# EAGLE schematic breakout_spartan6 (EAGLE 5.12)

## Sheet 1 of 4
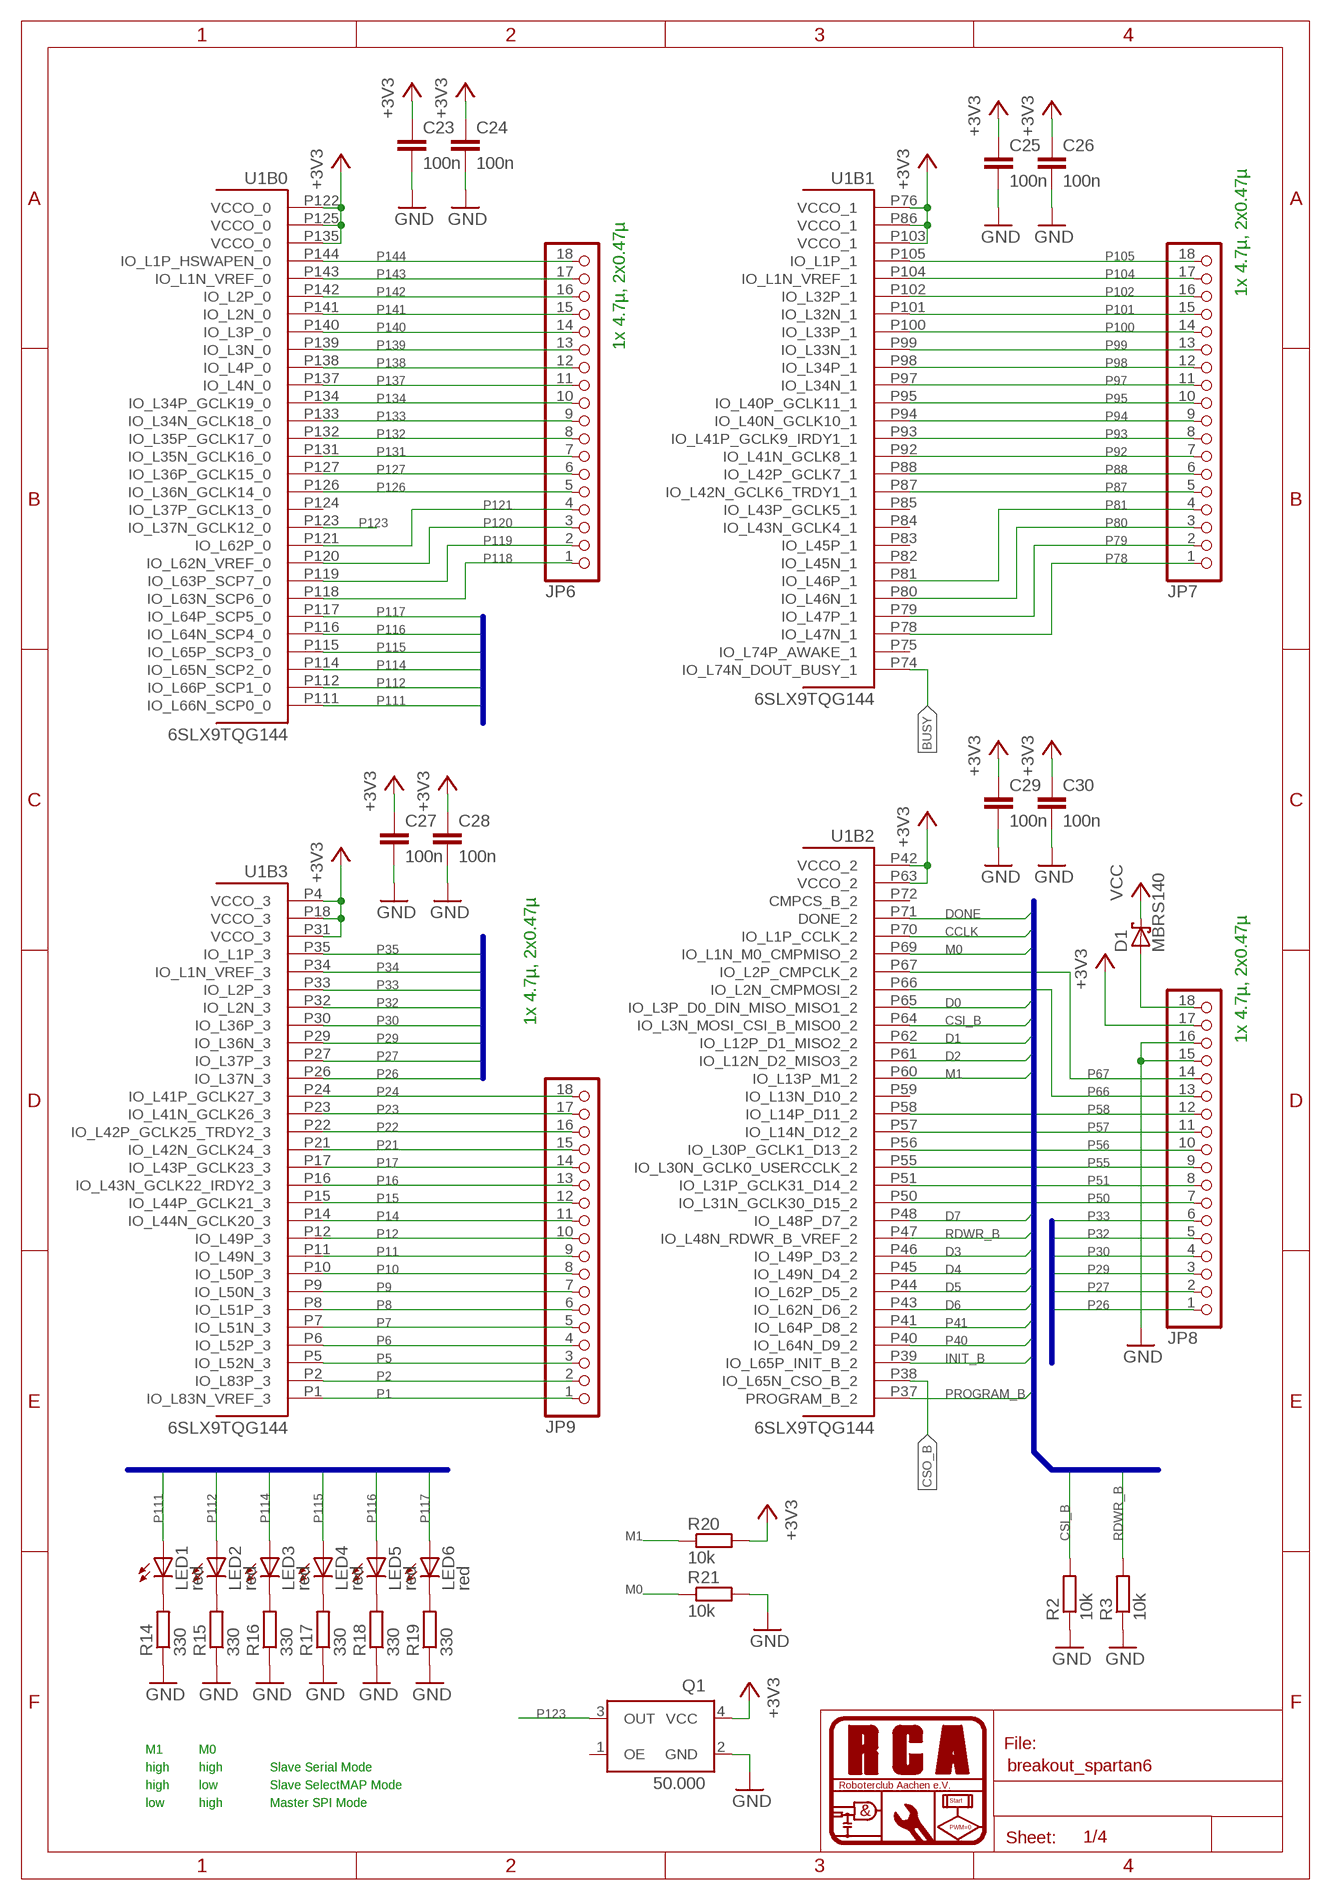
[diagram p0: schematic, sheet 1]

### Parts
C23  100n  C-EUC0603  [C0603]
C24  100n  C-EUC0603  [C0603]
C25  100n  C-EUC0603  [C0603]
C26  100n  C-EUC0603  [C0603]
C27  100n  C-EUC0603  [C0603]
C28  100n  C-EUC0603  [C0603]
C29  100n  C-EUC0603  [C0603]
C30  100n  C-EUC0603  [C0603]
D1  MBRS140  MBRS130LT3  [SMB]
JP6  PINHD-1X18_2.54  [1X18]
JP7  PINHD-1X18_2.54  [1X18]
JP8  PINHD-1X18_2.54  [1X18]
JP9  PINHD-1X18_2.54  [1X18]
LED1  red  LEDCHIP-LED0805  [CHIP-LED0805]
LED2  red  LEDCHIP-LED0805  [CHIP-LED0805]
LED3  red  LEDCHIP-LED0805  [CHIP-LED0805]
LED4  red  LEDCHIP-LED0805  [CHIP-LED0805]
LED5  red  LEDCHIP-LED0805  [CHIP-LED0805]
LED6  red  LEDCHIP-LED0805  [CHIP-LED0805]
Q1  50.000  XO53S  [XO53_SMALL]
R2  10k  R-EU_R0805  [R0805]
R3  10k  R-EU_R0805  [R0805]
R14  330  R-EU_R0805  [R0805]
R15  330  R-EU_R0805  [R0805]
R16  330  R-EU_R0805  [R0805]
R17  330  R-EU_R0805  [R0805]
R18  330  R-EU_R0805  [R0805]
R19  330  R-EU_R0805  [R0805]
R20  10k  R-EU_R0805  [R0805]
R21  10k  R-EU_R0805  [R0805]
U1  6SLX9TQG144  [TQ144]

### Nets
+3V3: C23.1 C24.1 C25.1 C26.1 C27.1 C28.1 C29.1 C30.1 JP8.17 Q1.4(VCC) R20.2 U1.P4(B3:VCCO_3) U1.P18(B3:VCCO_3) U1.P31(B3:VCCO_3) U1.P42(B2:VCCO_2) U1.P63(B2:VCCO_2) U1.P76(B1:VCCO_1) U1.P86(B1:VCCO_1) U1.P103(B1:VCCO_1) U1.P122(B0:VCCO_0) U1.P125(B0:VCCO_0) U1.P135(B0:VCCO_0) ; also sheet 2,4
BUSY: U1.P74(B1:IO_L74N_DOUT_BUSY_1)
CCLK: U1.P70(B2:IO_L1P_CCLK_2) ; also sheet 3
CSI_B: R2.2 U1.P64(B2:IO_L3N_MOSI_CSI_B_MISO0_2)
CSO_B: U1.P38(B2:IO_L65N_CSO_B_2)
D0: U1.P65(B2:IO_L3P_D0_DIN_MISO_MISO1_2) ; also sheet 3
D1: U1.P62(B2:IO_L12P_D1_MISO2_2) ; also sheet 3
D2: U1.P61(B2:IO_L12N_D2_MISO3_2) ; also sheet 3
D3: U1.P46(B2:IO_L49P_D3_2) ; also sheet 3
D4: U1.P45(B2:IO_L49N_D4_2) ; also sheet 3
D5: U1.P44(B2:IO_L62P_D5_2) ; also sheet 3
D6: U1.P43(B2:IO_L62N_D6_2) ; also sheet 3
D7: U1.P48(B2:IO_L48P_D7_2) ; also sheet 3
DONE: U1.P71(B2:DONE_2) ; also sheet 3
GND: C23.2 C24.2 C25.2 C26.2 C27.2 C28.2 C29.2 C30.2 JP8.15 JP8.16 Q1.2(GND) R2.1 R3.1 R14.1 R15.1 R16.1 R17.1 R18.1 R19.1 R21.2 ; also sheet 2,3,4
INIT_B: U1.P39(B2:IO_L65P_INIT_B_2) ; also sheet 3
M0: R21.1 U1.P69(B2:IO_L1N_M0_CMPMISO_2)
M1: R20.1 U1.P60(B2:IO_L13P_M1_2)
N$52: LED1.C R14.2
N$53: D1.A JP8.18
N$54: LED2.C R15.2
N$55: LED3.C R16.2
N$56: LED4.C R17.2
N$57: LED5.C R18.2
N$58: LED6.C R19.2
P1: JP9.1 U1.P1(B3:IO_L83N_VREF_3)
P2: JP9.2 U1.P2(B3:IO_L83P_3)
P5: JP9.3 U1.P5(B3:IO_L52N_3)
P6: JP9.4 U1.P6(B3:IO_L52P_3)
P7: JP9.5 U1.P7(B3:IO_L51N_3)
P8: JP9.6 U1.P8(B3:IO_L51P_3)
P9: JP9.7 U1.P9(B3:IO_L50N_3)
P10: JP9.8 U1.P10(B3:IO_L50P_3)
P11: JP9.9 U1.P11(B3:IO_L49N_3)
P12: JP9.10 U1.P12(B3:IO_L49P_3)
P14: JP9.11 U1.P14(B3:IO_L44N_GCLK20_3)
P15: JP9.12 U1.P15(B3:IO_L44P_GCLK21_3)
P16: JP9.13 U1.P16(B3:IO_L43N_GCLK22_IRDY2_3)
P17: JP9.14 U1.P17(B3:IO_L43P_GCLK23_3)
P21: JP9.15 U1.P21(B3:IO_L42N_GCLK24_3)
P22: JP9.16 U1.P22(B3:IO_L42P_GCLK25_TRDY2_3)
P23: JP9.17 U1.P23(B3:IO_L41N_GCLK26_3)
P24: JP9.18 U1.P24(B3:IO_L41P_GCLK27_3)
P26: JP8.1 U1.P26(B3:IO_L37N_3)
P27: JP8.2 U1.P27(B3:IO_L37P_3)
P29: JP8.3 U1.P29(B3:IO_L36N_3)
P30: JP8.4 U1.P30(B3:IO_L36P_3)
P32: JP8.5 U1.P32(B3:IO_L2N_3)
P33: JP8.6 U1.P33(B3:IO_L2P_3)
P34: U1.P34(B3:IO_L1N_VREF_3) ; also sheet 3
P35: U1.P35(B3:IO_L1P_3) ; also sheet 3
P40: U1.P40(B2:IO_L64N_D9_2) ; also sheet 3
P41: U1.P41(B2:IO_L64P_D8_2) ; also sheet 3
P50: JP8.7 U1.P50(B2:IO_L31N_GCLK30_D15_2)
P51: JP8.8 U1.P51(B2:IO_L31P_GCLK31_D14_2)
P55: JP8.9 U1.P55(B2:IO_L30N_GCLK0_USERCCLK_2)
P56: JP8.10 U1.P56(B2:IO_L30P_GCLK1_D13_2)
P57: JP8.11 U1.P57(B2:IO_L14N_D12_2)
P58: JP8.12 U1.P58(B2:IO_L14P_D11_2)
P66: JP8.13 U1.P66(B2:IO_L2N_CMPMOSI_2)
P67: JP8.14 U1.P67(B2:IO_L2P_CMPCLK_2)
P78: JP7.1 U1.P78(B1:IO_L47N_1)
P79: JP7.2 U1.P79(B1:IO_L47P_1)
P80: JP7.3 U1.P80(B1:IO_L46N_1)
P81: JP7.4 U1.P81(B1:IO_L46P_1)
P87: JP7.5 U1.P87(B1:IO_L42N_GCLK6_TRDY1_1)
P88: JP7.6 U1.P88(B1:IO_L42P_GCLK7_1)
P92: JP7.7 U1.P92(B1:IO_L41N_GCLK8_1)
P93: JP7.8 U1.P93(B1:IO_L41P_GCLK9_IRDY1_1)
P94: JP7.9 U1.P94(B1:IO_L40N_GCLK10_1)
P95: JP7.10 U1.P95(B1:IO_L40P_GCLK11_1)
P97: JP7.11 U1.P97(B1:IO_L34N_1)
P98: JP7.12 U1.P98(B1:IO_L34P_1)
P99: JP7.13 U1.P99(B1:IO_L33N_1)
P100: JP7.14 U1.P100(B1:IO_L33P_1)
P101: JP7.15 U1.P101(B1:IO_L32N_1)
P102: JP7.16 U1.P102(B1:IO_L32P_1)
P104: JP7.17 U1.P104(B1:IO_L1N_VREF_1)
P105: JP7.18 U1.P105(B1:IO_L1P_1)
P111: LED1.A U1.P111(B0:IO_L66N_SCP0_0)
P112: LED2.A U1.P112(B0:IO_L66P_SCP1_0)
P114: LED3.A U1.P114(B0:IO_L65N_SCP2_0)
P115: LED4.A U1.P115(B0:IO_L65P_SCP3_0)
P116: LED5.A U1.P116(B0:IO_L64N_SCP4_0)
P117: LED6.A U1.P117(B0:IO_L64P_SCP5_0)
P118: JP6.1 U1.P118(B0:IO_L63N_SCP6_0)
P119: JP6.2 U1.P119(B0:IO_L63P_SCP7_0)
P120: JP6.3 U1.P120(B0:IO_L62N_VREF_0)
P121: JP6.4 U1.P121(B0:IO_L62P_0)
P123: Q1.3(OUT) U1.P123(B0:IO_L37N_GCLK12_0)
P126: JP6.5 U1.P126(B0:IO_L36N_GCLK14_0)
P127: JP6.6 U1.P127(B0:IO_L36P_GCLK15_0)
P131: JP6.7 U1.P131(B0:IO_L35N_GCLK16_0)
P132: JP6.8 U1.P132(B0:IO_L35P_GCLK17_0)
P133: JP6.9 U1.P133(B0:IO_L34N_GCLK18_0)
P134: JP6.10 U1.P134(B0:IO_L34P_GCLK19_0)
P137: JP6.11 U1.P137(B0:IO_L4N_0)
P138: JP6.12 U1.P138(B0:IO_L4P_0)
P139: JP6.13 U1.P139(B0:IO_L3N_0)
P140: JP6.14 U1.P140(B0:IO_L3P_0)
P141: JP6.15 U1.P141(B0:IO_L2N_0)
P142: JP6.16 U1.P142(B0:IO_L2P_0)
P143: JP6.17 U1.P143(B0:IO_L1N_VREF_0)
P144: JP6.18 U1.P144(B0:IO_L1P_HSWAPEN_0)
PROGRAM_B: U1.P37(B2:PROGRAM_B_2) ; also sheet 3
RDWR_B: R3.2 U1.P47(B2:IO_L48N_RDWR_B_VREF_2)
VCC: D1.C ; also sheet 3,4
Unconnected: Q1.1(OE) U1.P59(B2:IO_L13N_D10_2) U1.P72(B2:CMPCS_B_2) U1.P75(B1:IO_L74P_AWAKE_1) U1.P82(B1:IO_L45N_1) U1.P83(B1:IO_L45P_1) U1.P84(B1:IO_L43N_GCLK4_1) U1.P85(B1:IO_L43P_GCLK5_1) U1.P124(B0:IO_L37P_GCLK13_0)

### Buses
CCLK,DONE,D[0..7],INIT_B,PROGRAM_B,CSI_B,RDWR_B,M[0..1],P[40..41]
P[26..27],P[29..30],P[32..35]
P[111..112],P[114..117]

### Notes on the sheet
- 1x 4.7µ, 2x0.47µ
- 1x 4.7µ, 2x0.47µ
- 1x 4.7µ, 2x0.47µ
- 1x 4.7µ, 2x0.47µ
- M1 | M0
- high | high | Slave Serial Mode
- high | low | Slave SelectMAP Mode
- low | high | Master SPI Mode

## Sheet 2 of 4
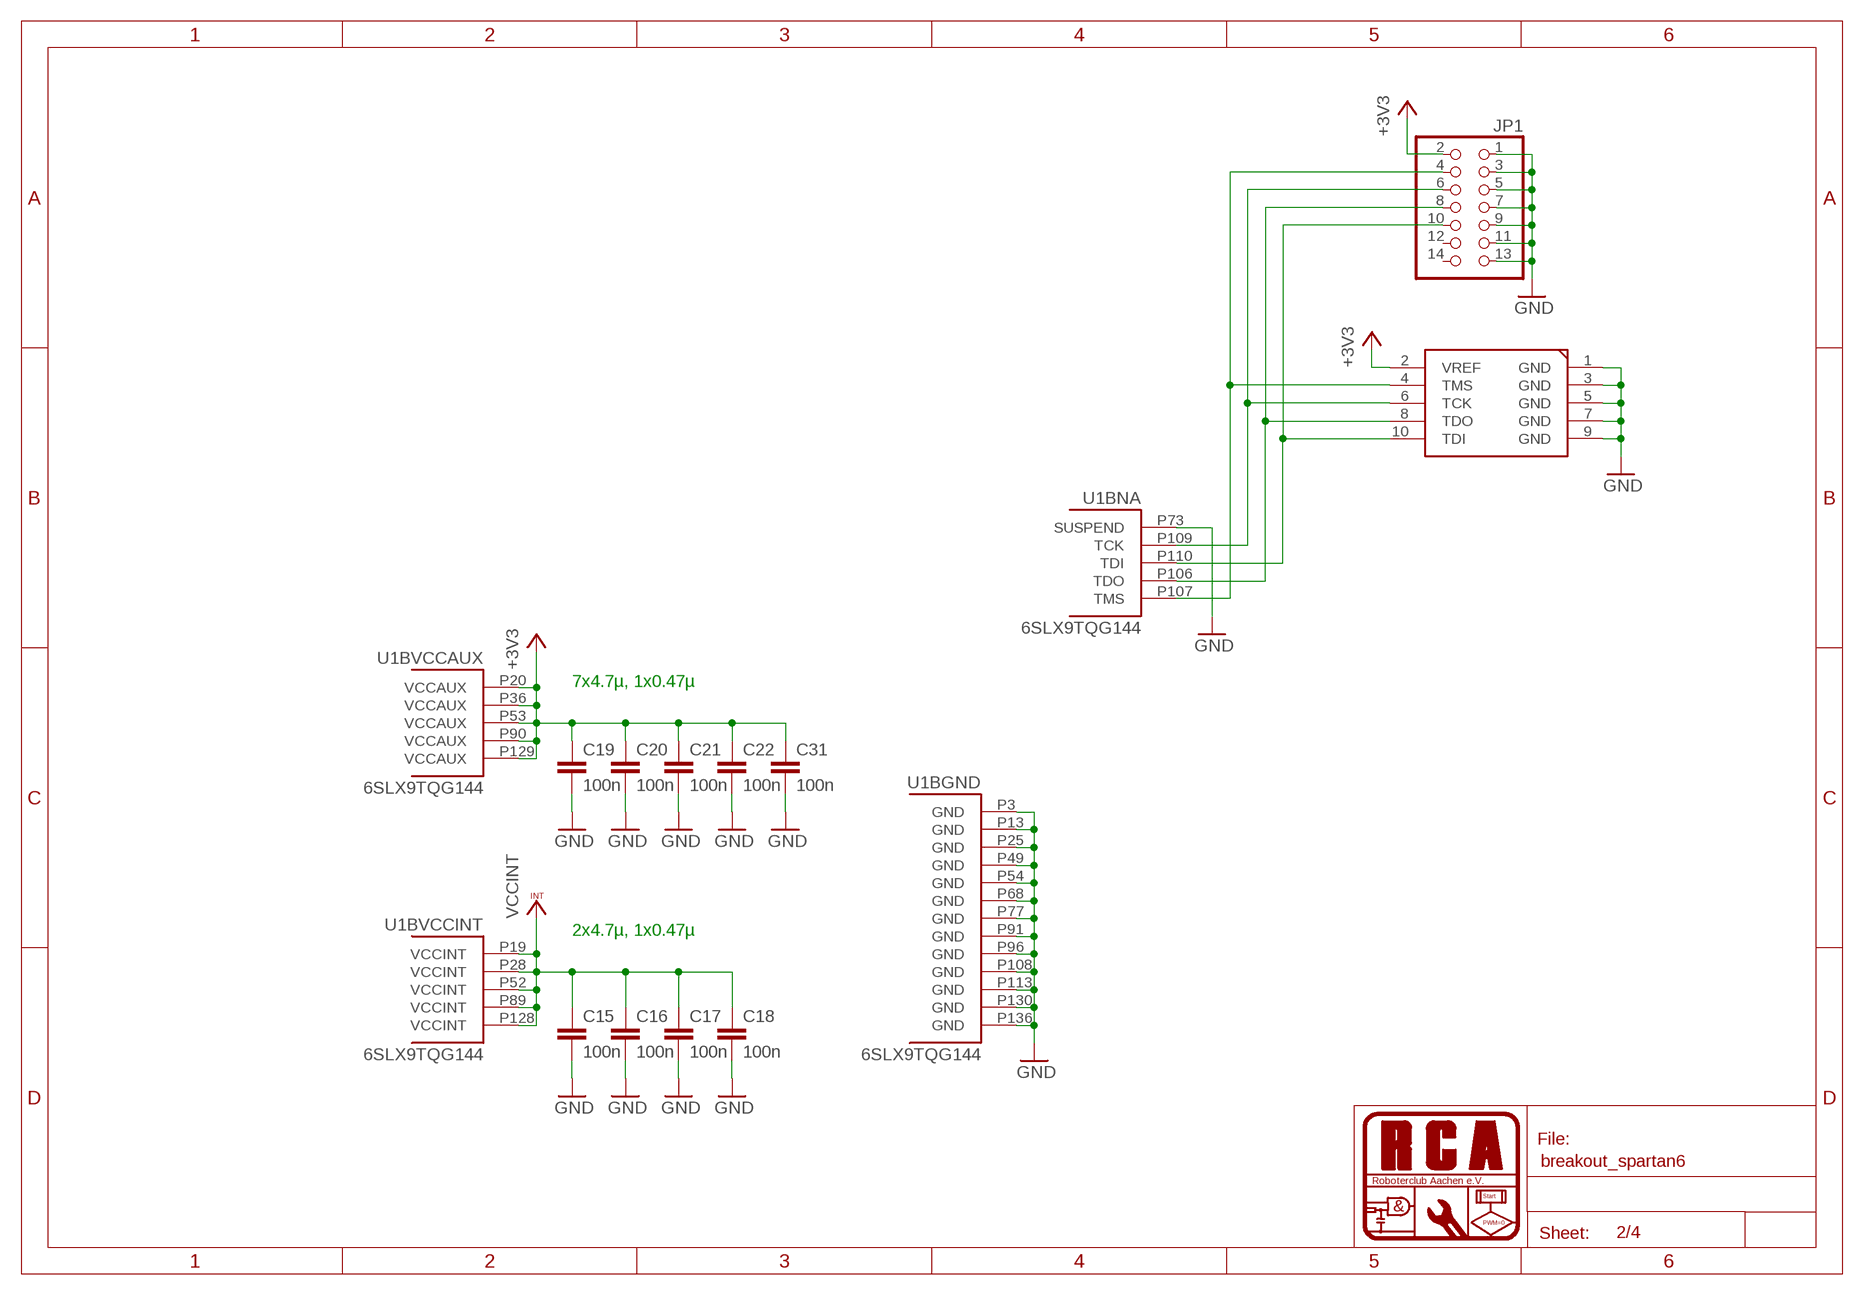
[diagram p1: schematic, sheet 2]

### Parts
C15  100n  C-EUC0603  [C0603]
C16  100n  C-EUC0603  [C0603]
C17  100n  C-EUC0603  [C0603]
C18  100n  C-EUC0603  [C0603]
C19  100n  C-EUC0603  [C0603]
C20  100n  C-EUC0603  [C0603]
C21  100n  C-EUC0603  [C0603]
C22  100n  C-EUC0603  [C0603]
C31  100n  C-EUC0603  [C0603]
J1  XILINX_JTAGSMD  [2X05SMD]
JP1  PINHD-2X7_2.00-SMD  [2X07M_SMD]

### Nets
+3V3: C19.1 C20.1 C21.1 C22.1 C31.1 J1.2(VREF) JP1.2 U1.P20(BVCCAUX:VCCAUX) U1.P36(BVCCAUX:VCCAUX) U1.P53(BVCCAUX:VCCAUX) U1.P90(BVCCAUX:VCCAUX) U1.P129(BVCCAUX:VCCAUX) ; also sheet 1,4
GND: C15.2 C16.2 C17.2 C18.2 C19.2 C20.2 C21.2 C22.2 C31.2 J1.1(GND) J1.3(GND) J1.5(GND) J1.7(GND) J1.9(GND) JP1.1 JP1.3 JP1.5 JP1.7 JP1.9 JP1.11 JP1.13 U1.P3(BGND:GND) U1.P13(BGND:GND) U1.P25(BGND:GND) U1.P49(BGND:GND) U1.P54(BGND:GND) U1.P68(BGND:GND) U1.P73(BNA:SUSPEND) U1.P77(BGND:GND) U1.P91(BGND:GND) U1.P96(BGND:GND) U1.P108(BGND:GND) U1.P113(BGND:GND) U1.P130(BGND:GND) U1.P136(BGND:GND) ; also sheet 1,3,4
N$1: J1.4(TMS) JP1.4 U1.P107(BNA:TMS)
N$2: J1.6(TCK) JP1.6 U1.P109(BNA:TCK)
N$3: J1.8(TDO) JP1.8 U1.P106(BNA:TDO)
N$4: J1.10(TDI) JP1.10 U1.P110(BNA:TDI)
VCCINT: C15.1 C16.1 C17.1 C18.1 U1.P19(BVCCINT:VCCINT) U1.P28(BVCCINT:VCCINT) U1.P52(BVCCINT:VCCINT) U1.P89(BVCCINT:VCCINT) U1.P128(BVCCINT:VCCINT) ; also sheet 4
Unconnected: JP1.12 JP1.14

### Notes on the sheet
- 7x4.7µ, 1x0.47µ
- 2x4.7µ, 1x0.47µ

## Sheet 3 of 4
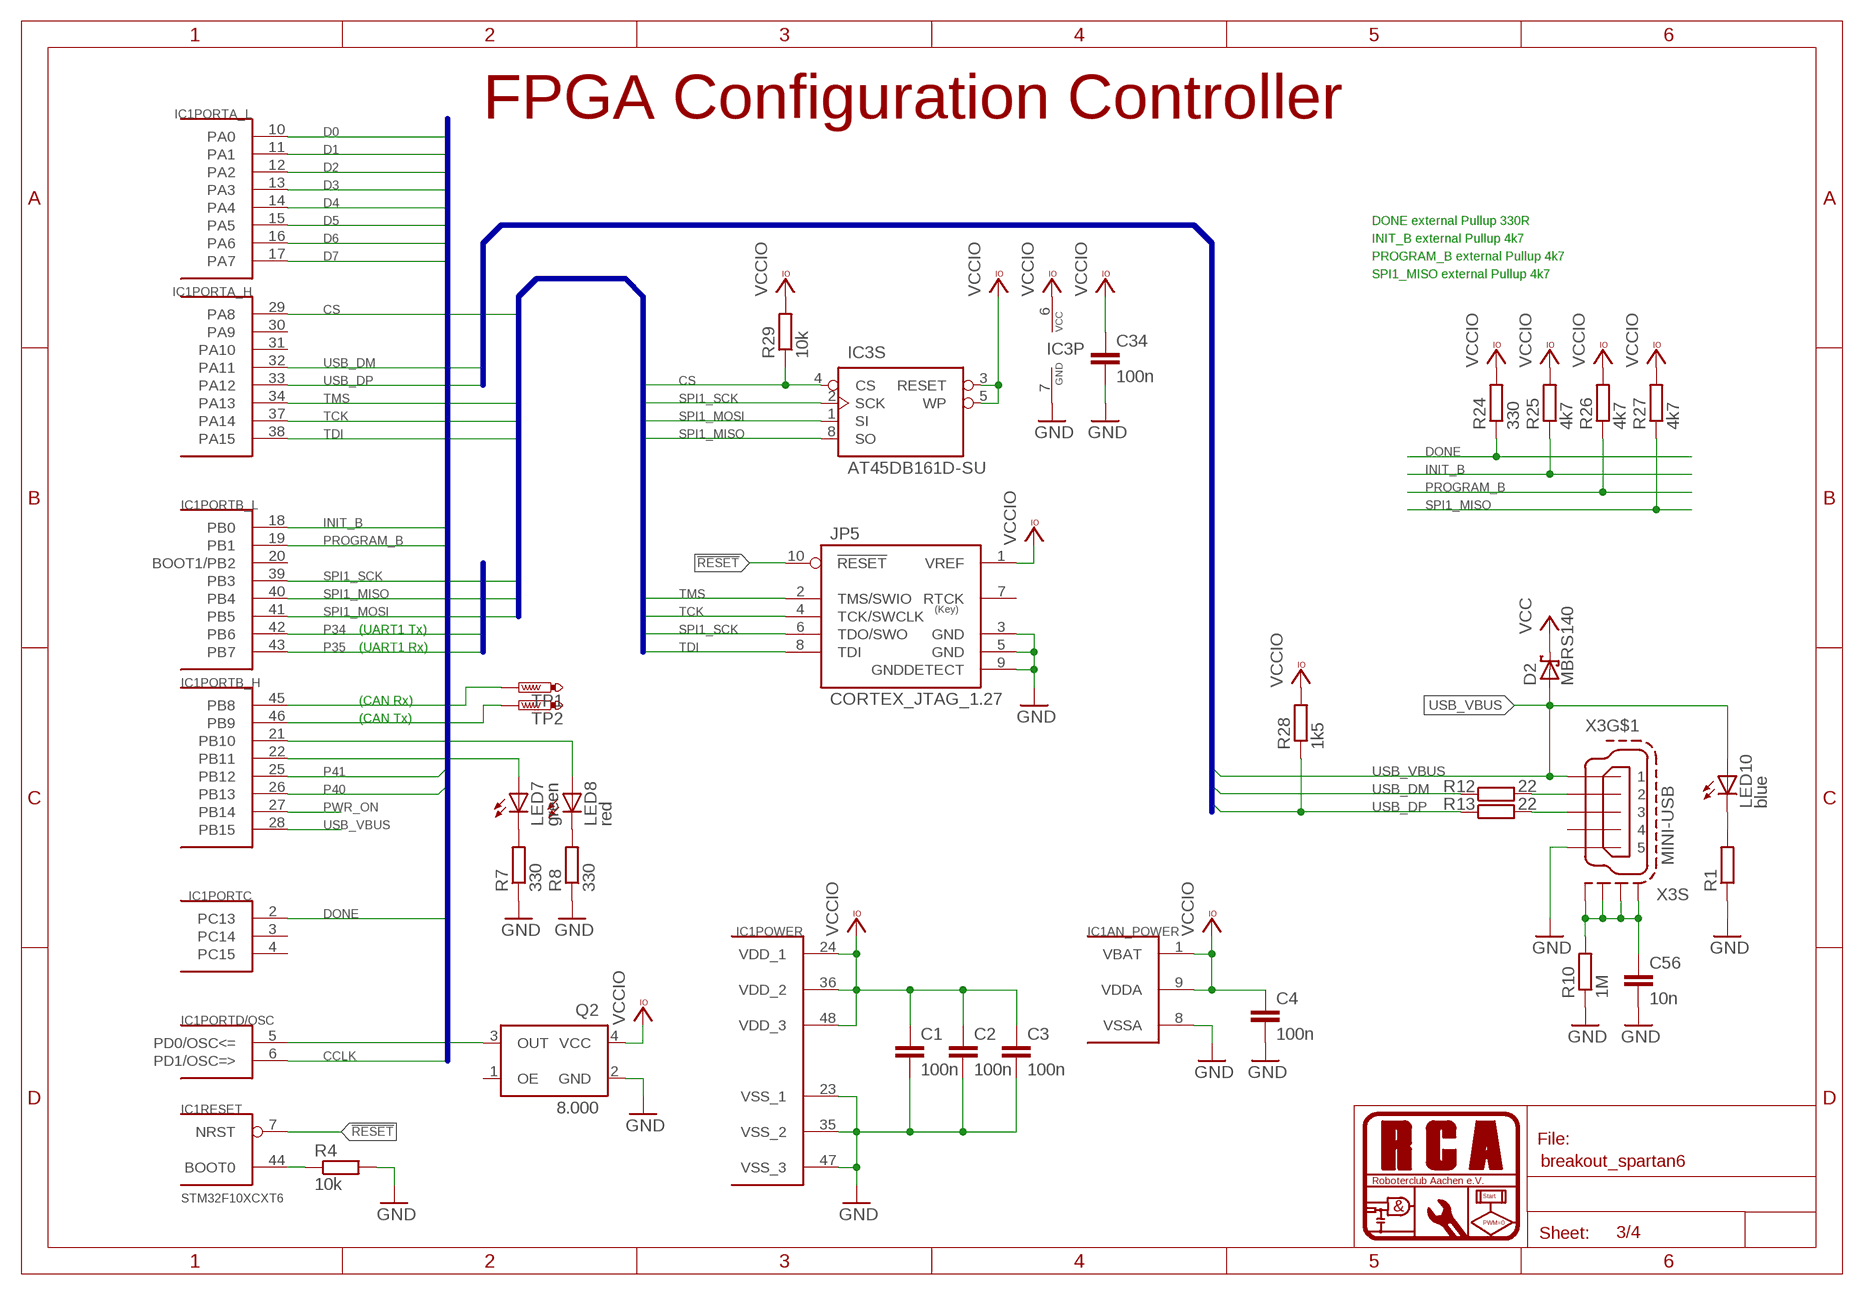
[diagram p2: schematic, sheet 3]

### Parts
C1  100n  C-EUC0603  [C0603]
C2  100n  C-EUC0603  [C0603]
C3  100n  C-EUC0603  [C0603]
C4  100n  C-EUC0603  [C0603]
C34  100n  C-EUC0805  [C0805]
C56  10n  C-EUC0603  [C0603]
D2  MBRS140  MBRS130LT3  [SMB]
IC1  STM32F10XCXT6  [TQFP48]
IC3  AT45DB161D-SU  AT45DB041DS  [SO-08M]
JP5  CORTEX_JTAG_1.27  [1365-10]
LED7  green  LEDCHIP-LED0805  [CHIP-LED0805]
LED8  red  LEDCHIP-LED0805  [CHIP-LED0805]
LED10  blue  LEDCHIPLED_0805  [CHIPLED_0805]
Q2  8.000  XO53S  [XO53_SMALL]
R1  R-EU_R0805  [R0805]
R4  10k  R-EU_R0805  [R0805]
R7  330  R-EU_R0805  [R0805]
R8  330  R-EU_R0805  [R0805]
R10  1M  R-EU_R0805  [R0805]
R12  22  R-EU_R0805  [R0805]
R13  22  R-EU_R0805  [R0805]
R24  330  R-EU_M0805  [M0805]
R25  4k7  R-EU_M0805  [M0805]
R26  4k7  R-EU_M0805  [M0805]
R27  4k7  R-EU_M0805  [M0805]
R28  1k5  R-EU_M0805  [M0805]
R29  10k  R-EU_M0805  [M0805]
TP1  PTR1B1,27  [B1,27]
TP2  PTR1B1,27  [B1,27]
X3  MINI-USB  MINI-USB-SCHIELD-32005-201  [32005-201]

### Nets
!RESET: IC1.7(RESET:NRST) JP5.10(!RESET)
CCLK: IC1.6(PORTD/OSC:PD1/OSC=>) ; also sheet 1
CS: IC1.29(PORTA_H:PA8) IC3.4(S:CS) R29.1
D0: IC1.10(PORTA_L:PA0) ; also sheet 1
D1: IC1.11(PORTA_L:PA1) ; also sheet 1
D2: IC1.12(PORTA_L:PA2) ; also sheet 1
D3: IC1.13(PORTA_L:PA3) ; also sheet 1
D4: IC1.14(PORTA_L:PA4) ; also sheet 1
D5: IC1.15(PORTA_L:PA5) ; also sheet 1
D6: IC1.16(PORTA_L:PA6) ; also sheet 1
D7: IC1.17(PORTA_L:PA7) ; also sheet 1
DONE: IC1.2(PORTC:PC13) R24.1 ; also sheet 1
GND: C1.2 C2.2 C3.2 C4.2 C34.2 C56.2 IC1.8(AN_POWER:VSSA) IC1.23(POWER:VSS_1) IC1.35(POWER:VSS_2) IC1.47(POWER:VSS_3) IC3.7(P:GND) JP5.3(GND) JP5.5(GND) JP5.9(GNDDETECT) Q2.2(GND) R1.1 R4.2 R7.1 R8.1 R10.1 X3.5 ; also sheet 1,2,4
INIT_B: IC1.18(PORTB_L:PB0) R25.1 ; also sheet 1
N$5: IC1.44(RESET:BOOT0) R4.1
N$16: R12.2 X3.2
N$17: R13.2 X3.3
N$30: IC1.45(PORTB_H:PB8) TP1.TP
N$31: IC1.46(PORTB_H:PB9) TP2.TP
N$33: LED10.C R1.2
N$42: C56.1 R10.2 X3.M1(S:S1) X3.M2(S:S2) X3.M3(S:S3) X3.M4(S:S4)
N$48: IC1.21(PORTB_H:PB10) LED8.A
N$49: IC1.22(PORTB_H:PB11) LED7.A
N$50: LED7.C R7.2
N$51: LED8.C R8.2
P34: IC1.42(PORTB_L:PB6) ; also sheet 1
P35: IC1.43(PORTB_L:PB7) ; also sheet 1
P40: IC1.26(PORTB_H:PB13) ; also sheet 1
P41: IC1.25(PORTB_H:PB12) ; also sheet 1
PD0: IC1.5(PORTD/OSC:PD0/OSC<=) Q2.3(OUT)
PROGRAM_B: IC1.19(PORTB_L:PB1) R26.1 ; also sheet 1
PWR_ON: IC1.27(PORTB_H:PB14) ; also sheet 4
SPI1_MISO: IC1.40(PORTB_L:PB4) IC3.8(S:SO) R27.1
SPI1_MOSI: IC1.41(PORTB_L:PB5) IC3.1(S:SI)
SPI1_SCK: IC1.39(PORTB_L:PB3) IC3.2(S:SCK) JP5.6(TDO/SWO)
TCK: IC1.37(PORTA_H:PA14) JP5.4(TCK/SWCLK)
TDI: IC1.38(PORTA_H:PA15) JP5.8(TDI)
TMS: IC1.34(PORTA_H:PA13) JP5.2(TMS/SWIO)
USB_DM: IC1.32(PORTA_H:PA11) R12.1
USB_DP: IC1.33(PORTA_H:PA12) R13.1 R28.1
USB_VBUS: D2.A IC1.28(PORTB_H:PB15) LED10.A X3.1
VCC: D2.C ; also sheet 1,4
VCCIO: C1.1 C2.1 C3.1 C4.1 C34.1 IC1.1(AN_POWER:VBAT) IC1.9(AN_POWER:VDDA) IC1.24(POWER:VDD_1) IC1.36(POWER:VDD_2) IC1.48(POWER:VDD_3) IC3.3(S:RESET) IC3.5(S:WP) IC3.6(P:VCC) JP5.1(VREF) Q2.4(VCC) R24.2 R25.2 R26.2 R27.2 R28.2 R29.2 ; also sheet 4
Unconnected: IC1.3(PORTC:PC14) IC1.4(PORTC:PC15) IC1.20(PORTB_L:BOOT1/PB2) IC1.30(PORTA_H:PA9) IC1.31(PORTA_H:PA10) JP5.7(RTCK) Q2.1(OE) X3.4

### Buses
USB_VBUS,USB_DM,USB_DP,USB_ID
CCLK,DONE,D[0..7],INIT_B,PROGRAM_B,CSI_B,RDWR_B,M[0..1],P[40..41]
CS,SPI1_SCK,SPI1_MOSI,SPI1_MISO,TMS,TCK,TDI
P[26..27],P[29..30],P[32..35]

### Notes on the sheet
- FPGA Configuration Controller
- DONE external Pullup 330R
- INIT_B external Pullup 4k7
- PROGRAM_B external Pullup 4k7
- SPI1_MISO external Pullup 4k7
- (UART1 Tx)
- (UART1 Rx)
- (CAN Rx)
- (CAN Tx)

## Sheet 4 of 4
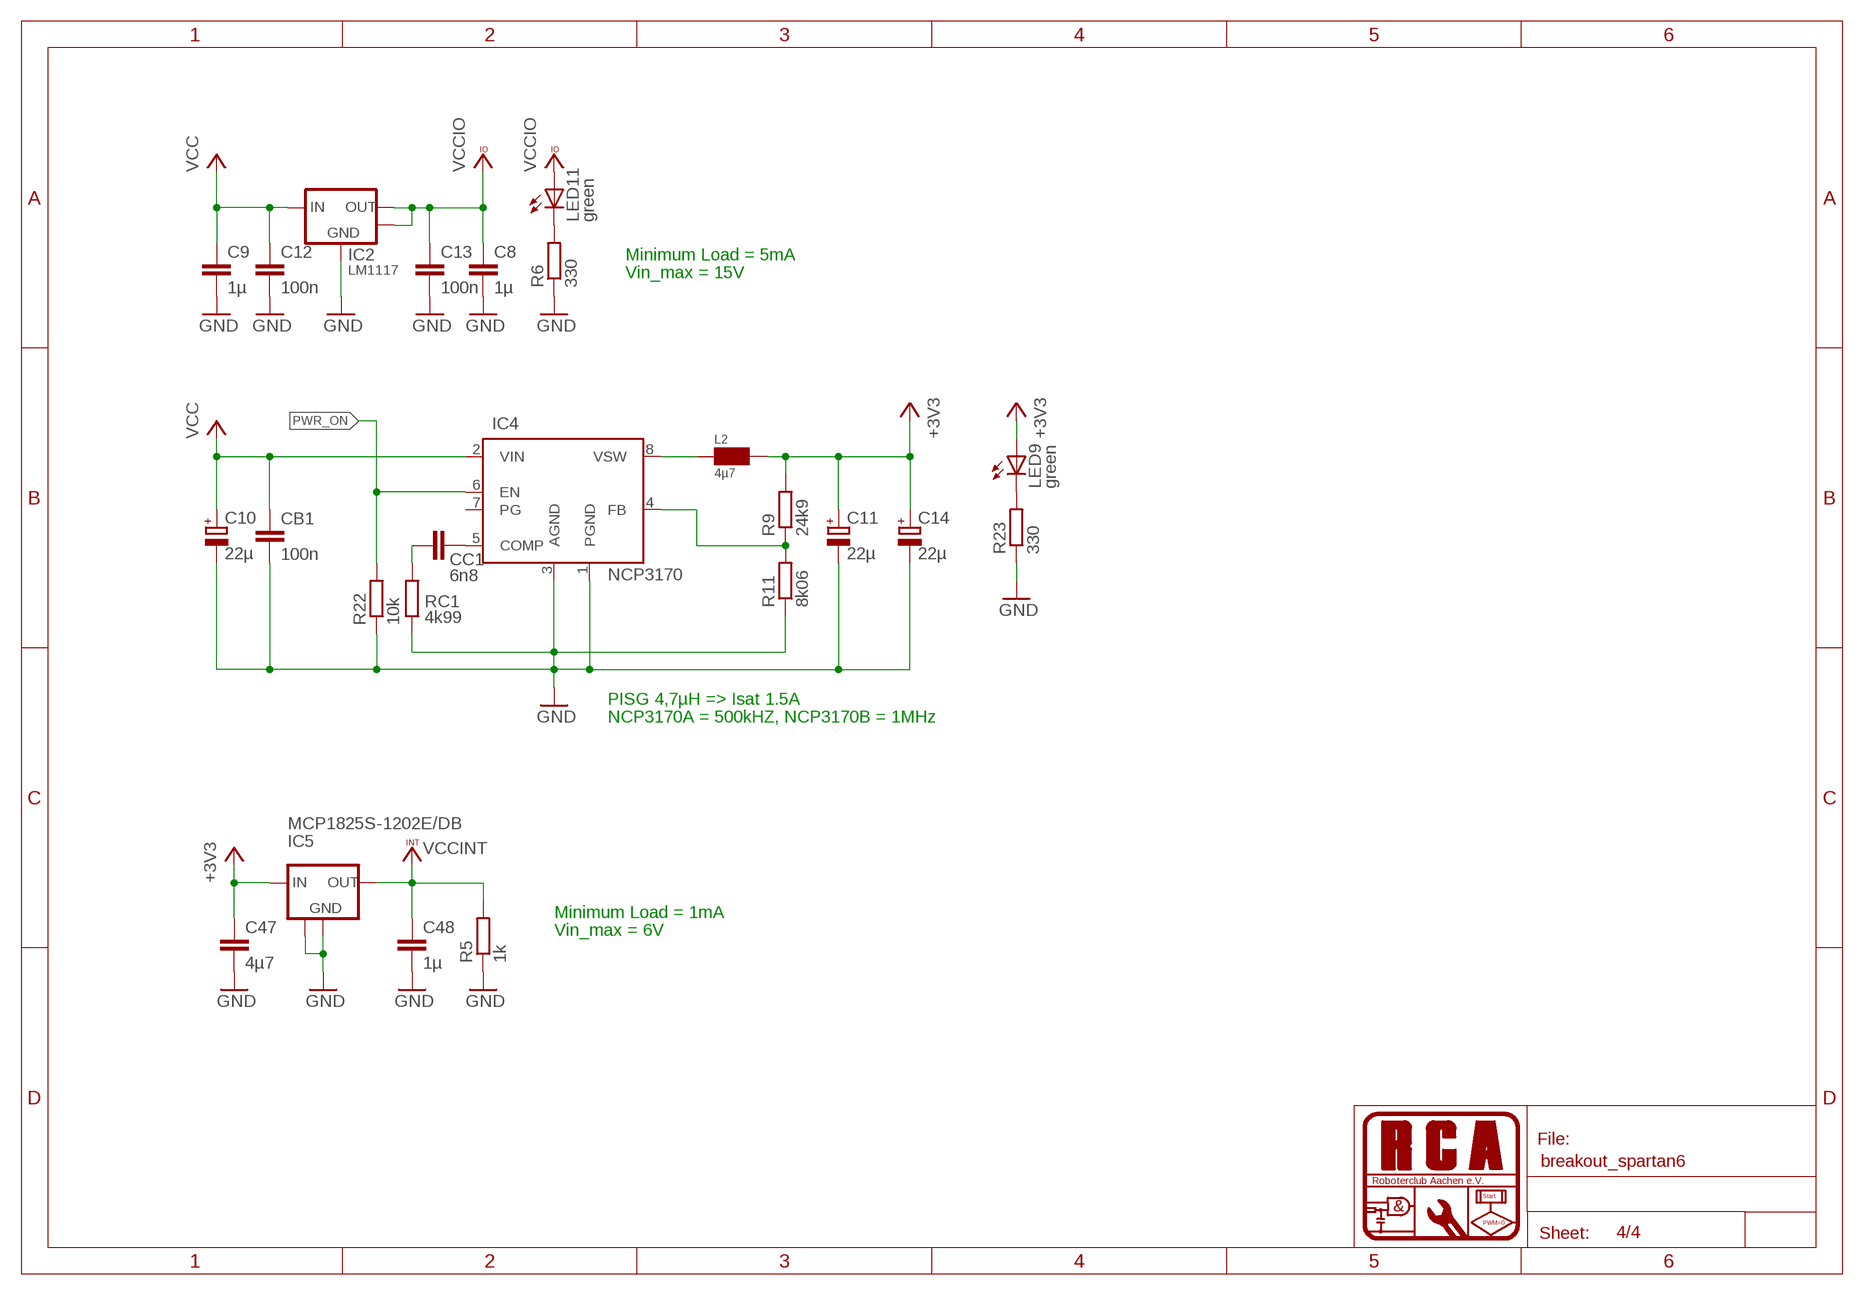
[diagram p3: schematic, sheet 4]

### Parts
C8  1µ  C-EUC0805  [C0805]
C9  1µ  C-EUC0805  [C0805]
C10  22µ  CPOL-EUSMCD  [SMC_D]
C11  22µ  CPOL-EUSMCC  [SMC_C]
C12  100n  C-EUC0603  [C0603]
C13  100n  C-EUC0603  [C0603]
C14  22µ  CPOL-EUSMCC  [SMC_C]
C47  4µ7  C-EUC0805  [C0805]
C48  1µ  C-EUC0805  [C0805]
CB1  100n  C-EUC0805  [C0805]
CC1  6n8  C-EUC0805  [C0805]
IC2  LM1117  [SOT223]
IC4  NCP3170  [SO08]
IC5  MCP1825S-1202E/DB  MCP1825DB  [SOT223]
L2  4µ7  INDUCTOR-PISG  [L-PISG]
LED9  green  LEDCHIP-LED0805  [CHIP-LED0805]
LED11  green  LEDCHIP-LED0805  [CHIP-LED0805]
R5  1k  R-EU_R0805  [R0805]
R6  330  R-EU_R0805  [R0805]
R9  24k9  R-EU_M0805  [M0805]
R11  8k06  R-EU_M0805  [M0805]
R22  10k  R-EU_M0805  [M0805]
R23  330  R-EU_R0805  [R0805]
RC1  4k99  R-EU_M0805  [M0805]

### Nets
+3V3: C11.+ C14.+ C47.1 IC5.1(IN) L2.2 LED9.A R9.2 ; also sheet 1,2
GND: C8.2 C9.2 C10.- C11.- C12.2 C13.2 C14.- C47.2 C48.2 CB1.2 IC2.1(GND) IC4.1(PGND) IC4.3(AGND) IC5.2(GND) IC5.4(GND) R5.1 R6.1 R11.1 R22.1 R23.1 RC1.1 ; also sheet 1,2,3
N$6: LED9.C R23.2
N$7: LED11.C R6.2
N$44: CC1.2 RC1.2
N$45: CC1.1 IC4.5(COMP)
N$46: IC4.8(VSW) L2.1
N$47: IC4.4(FB) R9.1 R11.2
PWR_ON: IC4.6(EN) R22.2 ; also sheet 3
VCC: C9.1 C10.+ C12.1 CB1.1 IC2.3(IN) IC4.2(VIN) ; also sheet 1,3
VCCINT: C48.1 IC5.3(OUT) R5.2 ; also sheet 2
VCCIO: C8.1 C13.1 IC2.2(OUT) IC2.4(OUT) LED11.A ; also sheet 3
Unconnected: IC4.7(PG)

### Notes on the sheet
- Minimum Load = 5mA
- Vin_max = 15V
- PISG 4,7µH => Isat 1.5A
- NCP3170A = 500kHZ, NCP3170B = 1MHz
- Minimum Load = 1mA
- Vin_max = 6V

## Library data of the parts
C1-C4 C8 C9 C12 C13 C15-C31 C34 C47 C48 C56 CB1 CC1 = rcl:C-EU: CAPACITOR, European symbol
C10 C11 C14 = rcl:CPOL-EU: POLARIZED CAPACITOR, European symbol
D1 D2 = diode:MBRS130LT3: Schottky Power Rectifier Source: http://www.onsemi.com/pub/Collateral/MBRS130LT3-D.PDF
IC1 = stm32:STM32F10XCXT6: ST STM32F101/103 48pin LQFP
IC2 = rca_spgversorgung:LM1117: LM1117 800mA Low-Dropout Linear Regulator
IC3 = rca_ic:AT45DB: AT45DBxxxD Single 2.5V or 2.7V to 3.6V Supply Serial Interface: 66 MHz Maximum Clock Frequency AT45DB041D: 4,325,376 bits of memory as 2,048 pages of 256 bytes
IC4 = rca_spgversorgung:NCP3170: Synchronous PWM Switching Converter The NCP3170 is a flexible synchronous PWM Switching Buck Regulator. The NCP3170 operates from 4.5V to 18V, sourcing up to 3A and is capable of producing output voltages as low as 0.8V. The NCP3170 also incorporates current mode control. To reduce the number of external components, a number of features are internally set including soft start, power good detection, and switching frequency. The NCP3170 is currently available in an SOIC-8 package.
IC5 = rca_spgversorgung:MCP182*
J1 = rca_stecker:XILINX_JTAG: Xilinx JTAG
JP1 = pinhead2:PINHD-2X7: PIN HEADER
JP5 = rca_stecker:CORTEX_JTAG: TCLK is SWCLK (Serial Wire Clock) TMS is SWDIO (Serial Wire debug Data Input/Output) TDO is SWO (Serial Wire trace Output)
JP6-JP9 = pinhead2:PINHD-1X18: PIN HEADER
L2 = rca_sontiges:INDUCTOR: SMD-Power-Induktivitäten z.B. PISM, Ferrit, 150µ, Reichelt Bestellnr.: L-PISM 150µ
LED1-LED11 = led:LED: LED OSRAM: - CHIPLED LG R971, LG N971, LY N971, LG Q971, LY Q971, LO R971, LY R971 LH N974, LH R974 LS Q976, LO Q976, LY Q976 LO Q996 - Hyper CHIPLED LW Q18S LB Q993, LB Q99A, LB R99A - SideLED LS A670, LO A670, LY A670, LG A670, LP A670 LB A673, LV A673, LT A673, LW A673 LH A674 LY A675 LS A676, LA A676, LO A676, LY A676, LW A676 LS A679, LY A679, LG A679 - Hyper Micro SIDELED® LS Y876, LA Y876, LO Y876, LY Y876 LT Y87S - SmartLED LW L88C, LW L88S LB L89C, LB L89S, LG L890 LS L89K, LO L89K, LY L89K LS L896, LA L896, LO L896, LY L896 - TOPLED LS T670, LO T670, LY T670, LG T670, LP T670 LSG T670, LSP T670, LSY T670, LOP T670, LYG T670 LG T671, LOG T671, LSG T671 LB T673, LV T673, LT T673, LW T673 LH T674 LS T676, LA T676, LO T676, LY T676, LB T676, LH T676, LSB T676, LW T676 LB T67C, LV T67C, LT T67C, LS T67K, LO T67K, LY T67K, LW E67C LS E67B, LA E67B, LO E67B, LY E67B, LB E67C, LV E67C, LT E67C LW T67C LS T679, LY T679, LG T679 LS T770, LO T770, LY T770, LG T770, LP T770 LB T773, LV T773, LT T773, LW T773 LH T774 LS E675, LA E675, LY E675, LS T675 LS T776, LA T776, LO T776, LY T776, LB T776 LHGB T686 LT T68C, LB T68C - Hyper Mini TOPLED® LB M676 - Mini TOPLED Santana® LG M470 LS M47K, LO M47K, LY M47K Source: http://www.osram.convergy.de LUXEON: - LUMILED® LXK2-PW12-R00, LXK2-PW12-S00, LXK2-PW14-U00, LXK2-PW14-V00 LXK2-PM12-R00, LXK2-PM12-S00, LXK2-PM14-U00 LXK2-PE12-Q00, LXK2-PE12-R00, LXK2-PE12-S00, LXK2-PE14-T00, LXK2-PE14-U00 LXK2-PB12-K00, LXK2-PB12-L00, LXK2-PB12-M00, LXK2-PB14-N00, LXK2-PB14-P00, LXK2-PB14-Q00 LXK2-PR12-L00, LXK2-PR12-M00, LXK2-PR14-Q00, LXK2-PR14-R00 LXK2-PD12-Q00, LXK2-PD12-R00, LXK2-PD12-S00 LXK2-PH12-R00, LXK2-PH12-S00 LXK2-PL12-P00, LXK2-PL12-Q00, LXK2-PL12-R00 Source: www.luxeon.com KINGBRIGHT: KA-3528ASYC Source: www.kingbright.com
Q1 Q2 = rca_sontiges:XO: XO91 Series Oscillators Frequency Range 500 kHz to 125 MHz Supply voltage range 1.8, 2.5, 3.3 or 5.0 Volts Gibt es in der 3,3V Version bei Reichelt (XO91 #Wert) Datenblatt: http://www.reichelt.de/?;ACTION=7;LA=6;OPEN=0;INDEX=0;FILENAME=B400%252FXO91.pdf XO53 Series Oscillators Frequency Range 2.5 MHz to 125 MHz Supply voltage range 1.8, 2.5, 3.3 Volts Gibt es in der 3,3V Version bei Reichelt (XO53 #Wert)
R1-R29 RC1 = rcl:R-EU_: RESISTOR, European symbol
TP1 TP2 = testpad:PTR1: TEST PIN
U1 = xilinx_devices:6SLX9TQG144: Xilinx FPGA: 6SLX9TQG144
X3 = con-cypressindustries:MINI-USB-SCHIELD-: MINI USB-B Conector Source: www.cypressindustries.com; OC_FARNELL: unknown; OC_NEWARK: unknown